# EAGLE design RF-Gen_Controller (EAGLE 6.1)

## Sheet 1 of 3
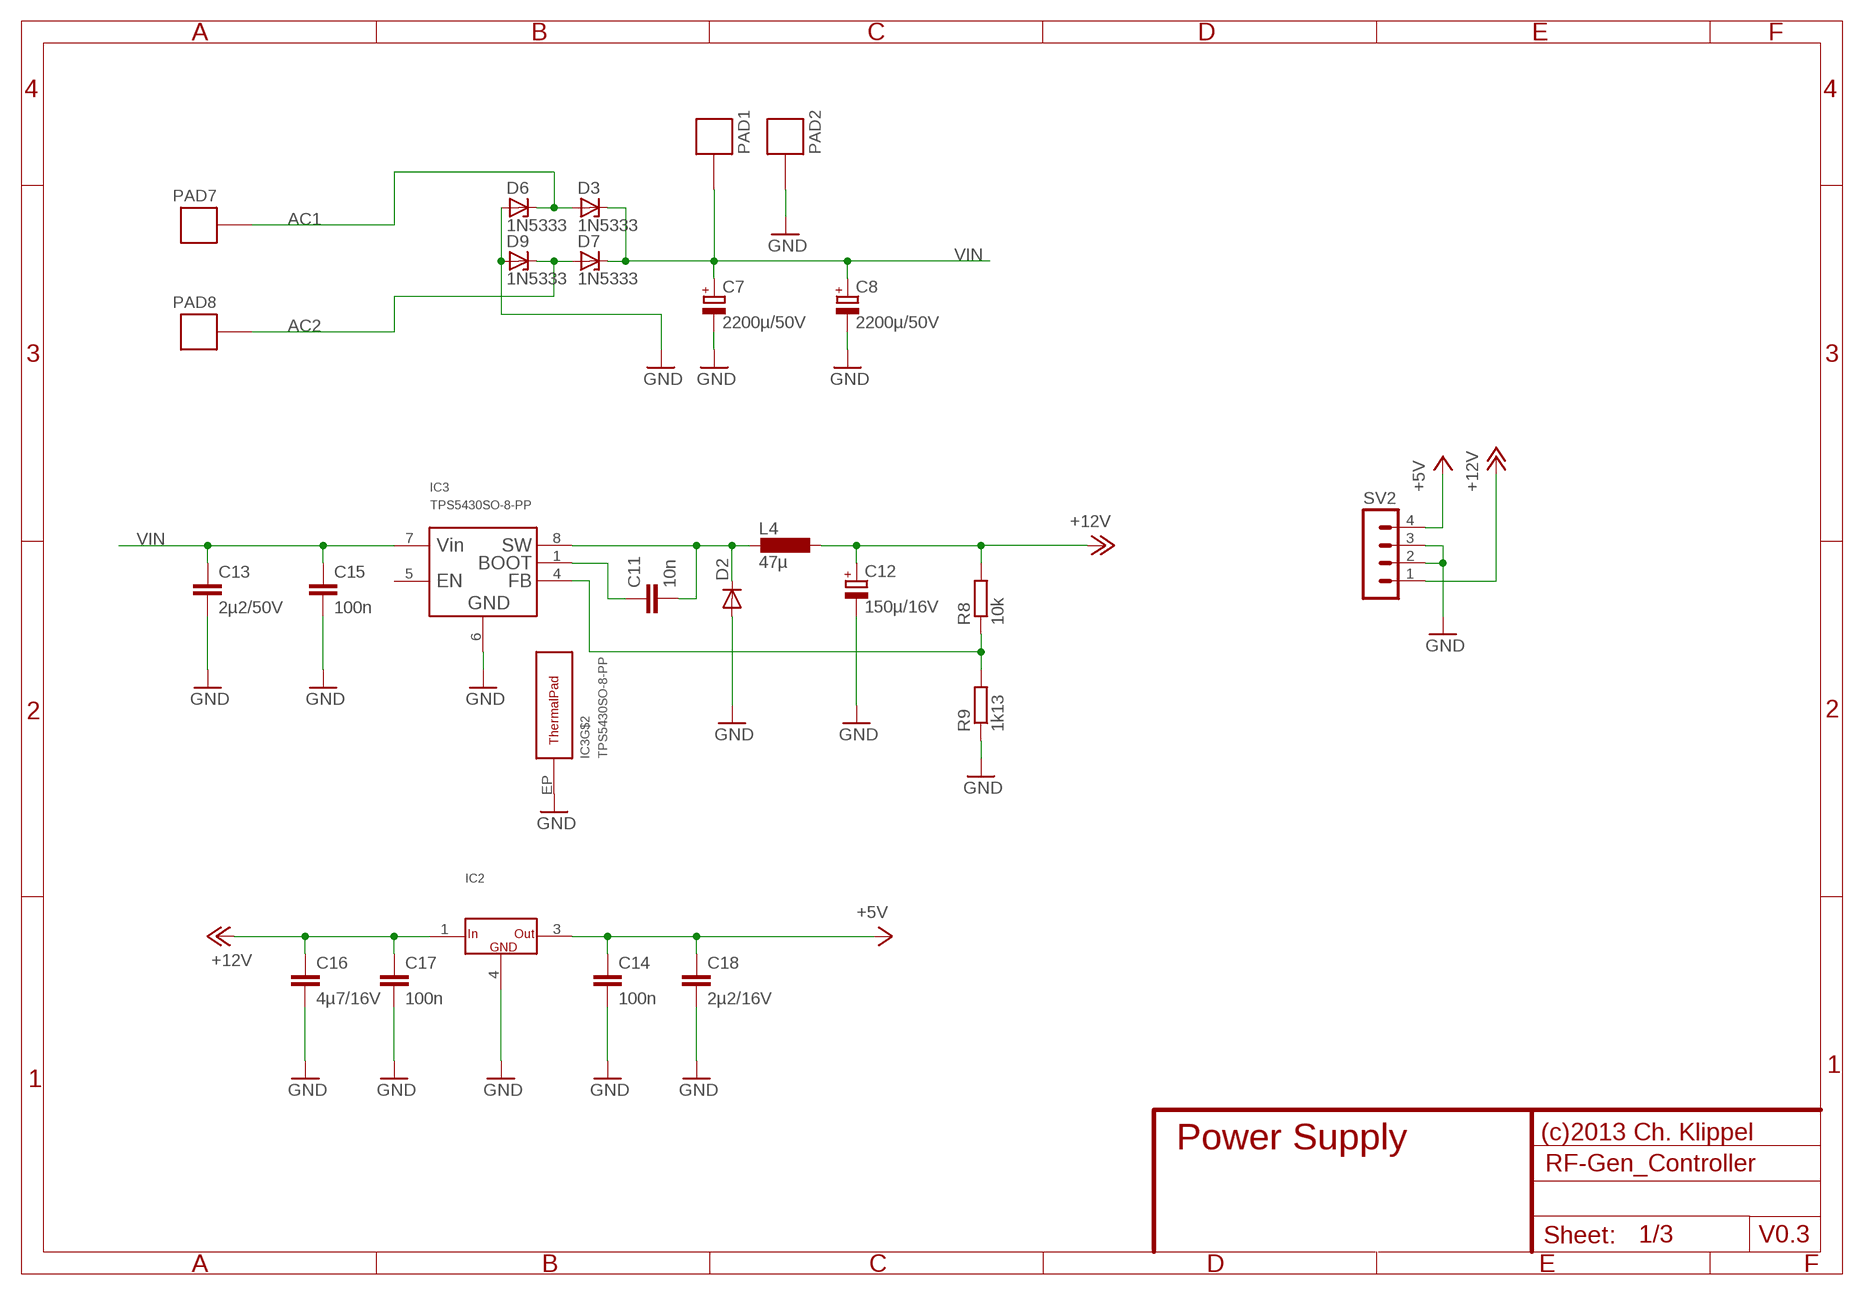
[diagram p0: schematic, sheet 1]

### Parts
C7  2200µ/50V  C-POL-EU-EEUHD1H_VERT2  [CAP_EEUHD1H_VERT2]
C8  2200µ/50V  C-POL-EU-EEUHD1H_VERT2  [CAP_EEUHD1H_VERT2]
C11  10n  C-EU-1206  [C_1206_REFLOW]
C12  150µ/16V  C-POL-EU-AL_100_108  [CAP_AL_100_108]
C13  2µ2/50V  C-EU-1210  [C_1210_REFLOW]
C14  100n  C-EU-0805  [C_0805_REFLOW]
C15  100n  C-EU-0805  [C_0805_REFLOW]
C16  4µ7/16V  C-EU-1210  [C_1210_REFLOW]
C17  100n  C-EU-0805  [C_0805_REFLOW]
C18  2µ2/16V  C-EU-1210  [C_1210_REFLOW]
D2  DIODE-SMB  [SMB]
D3  1N5333  [C1702-15]
D6  1N5333  [C1702-15]
D7  1N5333  [C1702-15]
D9  1N5333  [C1702-15]
IC2  VREG_3DPAK-3  [DPAK-3]
IC3  TPS5430SO-8-PP  [SO-8-PP]
L4  47µ  L-EU-SSR1260  [SSR1260]
PAD1  SOLPAD5MM  [SOLPAD_5]
PAD2  SOLPAD5MM  [SOLPAD_5]
PAD7  SOLPAD5MM  [SOLPAD_5]
PAD8  SOLPAD5MM  [SOLPAD_5]
R8  10k  R-EU-0805  [R_0805_REFLOW]
R9  1k13  R-EU-0805  [R_0805_REFLOW]
SV2  MA04-1  [MA04-1]

### Nets
+5V: C14.P$1 C18.P$1 IC2.3(OUT) SV2.4 ; also sheet 2,3
+12V: C12.+ C16.P$1 C17.P$1 IC2.1(IN) L4.1 R8.P$2 SV2.1 ; also sheet 3
AC1: D3.A D6.C PAD7.P$1
AC2: D7.A D9.C PAD8.P$1
GND: C7.- C8.- C12.- C13.P$2 C14.P$2 C15.P$2 C16.P$2 C17.P$2 C18.P$2 D2.A D6.A D9.A IC2.4(GND) IC3.6(GND) IC3.EP(THERMALPAD) PAD2.P$1 R9.P$1 SV2.2 SV2.3 ; also sheet 2,3
N$11: C11.P$1 IC3.1(BOOT)
N$13: IC3.4(FB) R8.P$1 R9.P$2
SW12: C11.P$2 D2.C IC3.8(SW) L4.2
VIN: C7.+ C8.+ C13.P$1 C15.P$1 D3.C D7.C IC3.7(VIN) PAD1.P$1 ; also sheet 3
Unconnected: IC3.5(EN)

### Notes on the sheet
- (c)2013 Ch. Klippel
- Power Supply
- V0.3

## Sheet 2 of 3
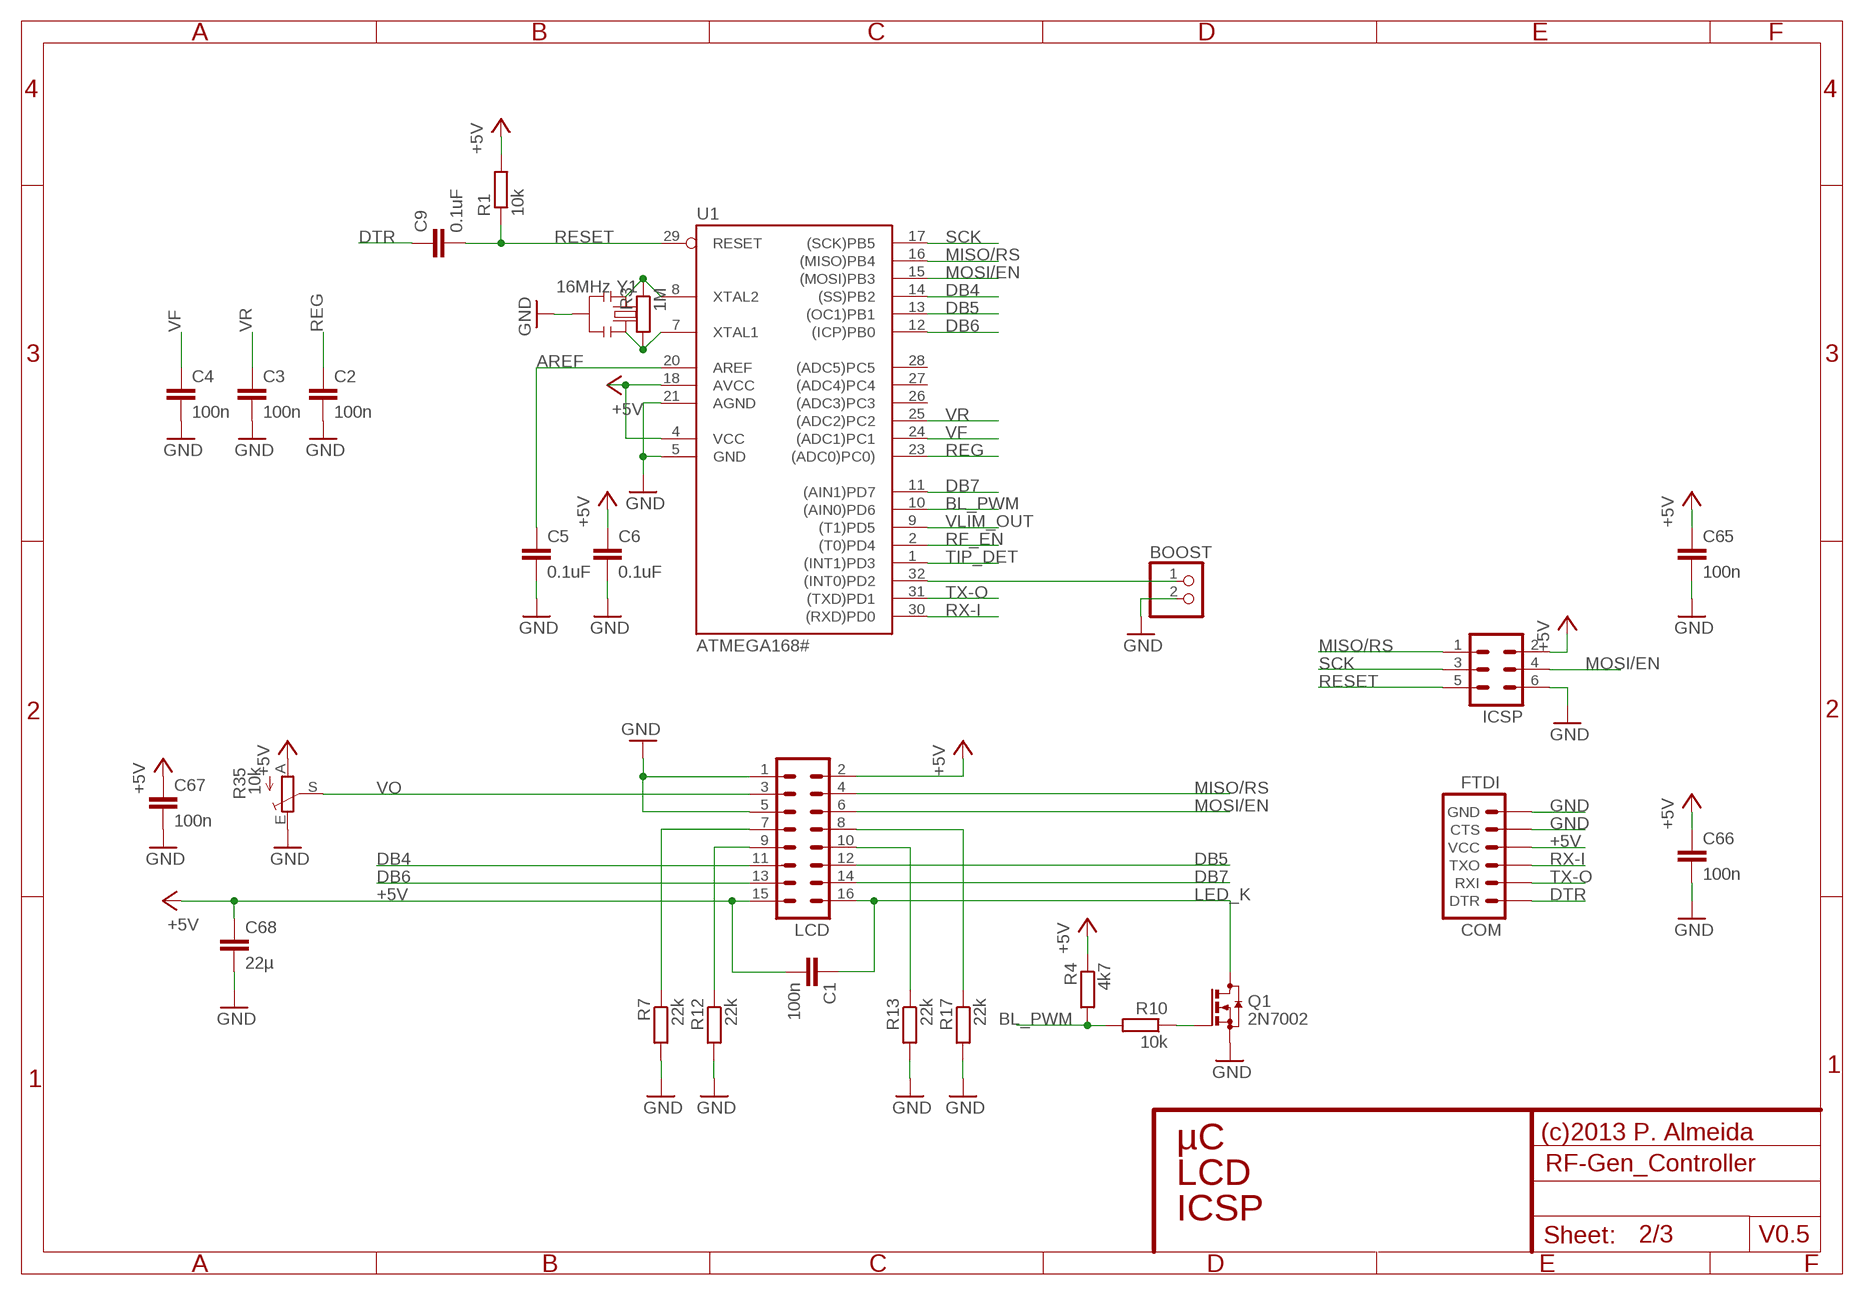
[diagram p1: schematic, sheet 2]

### Parts
BOOST  PINHD-1X2/90  [1X02/90]
C1  100n  C-EU-0805  [C_0805_REFLOW]
C2  100n  C-EU-0805  [C_0805_REFLOW]
C3  100n  C-EU-0805  [C_0805_REFLOW]
C4  100n  C-EU-0805  [C_0805_REFLOW]
C5  0.1uF  C-EU-0805  [C_0805_REFLOW]
C6  0.1uF  C-EU-0805  [C_0805_REFLOW]
C9  0.1uF  C-EU-0805  [C_0805_REFLOW]
C65  100n  C-EU-0805  [C_0805_REFLOW]
C66  100n  C-EU-0805  [C_0805_REFLOW]
C67  100n  C-EU-0805  [C_0805_REFLOW]
C68  22µ  C-EU-1206  [C_1206_REFLOW]
FTDI  COM  ARDUINO_SERIAL_PROGRAMPTH  [1X06]
ICSP  ML6  [ML6]
LCD  ML16  [ML16]
Q1  2N7002  BSS123  [SOT23]
R1  10k  R-EU-0805  [R_0805_REFLOW]
R3  1M  R-EU-0805  [R_0805_REFLOW]
R4  4k7  R-EU-0805  [R_0805_REFLOW]
R7  22k  R-EU-0805  [R_0805_REFLOW]
R10  10k  R-EU-0805  [R_0805_REFLOW]
R12  22k  R-EU-0805  [R_0805_REFLOW]
R13  22k  R-EU-0805  [R_0805_REFLOW]
R17  22k  R-EU-0805  [R_0805_REFLOW]
R35  10k  TRIM_EU-3364W  [3364W]
U1  ATMEGA168#  AT90S4433A  [TQFP32-08]
Y1  16MHz  RESONATORSMD  [RESONATOR-SMD]

### Nets
+5V: C1.P$2 C6.P$1 C65.P$1 C66.P$1 C67.P$1 C68.P$1 FTDI.4(VCC) ICSP.2 LCD.2 LCD.15 R1.P$2 R4.P$1 R35.A U1.4(VCC) U1.18(AVCC) ; also sheet 1,3
AREF: C5.P$1 U1.20(AREF)
BL_PWM: R4.P$2 R10.P$2 U1.10((AIN0)PD6)
DB4: LCD.11 U1.14((SS)PB2)
DB5: LCD.12 U1.13((OC1)PB1)
DB6: LCD.13 U1.12((ICP)PB0)
DB7: LCD.14 U1.11((AIN1)PD7)
DTR: C9.P$1 FTDI.1(DTR)
GND: BOOST.2 C2.P$2 C3.P$2 C4.P$2 C5.P$2 C6.P$2 C65.P$2 C66.P$2 C67.P$2 C68.P$2 FTDI.5(CTS) FTDI.6(GND) ICSP.6 LCD.1 LCD.5 Q1.2(S) R7.P$2 R12.P$2 R13.P$2 R17.P$2 R35.E U1.5(GND) U1.21(AGND) Y1.2 ; also sheet 1,3
LED_K: C1.P$1 LCD.16 Q1.3(D)
MISO/RS: ICSP.1 LCD.4 U1.16((MISO)PB4)
MOSI/EN: ICSP.4 LCD.6 U1.15((MOSI)PB3)
N$3: LCD.9 R12.P$1
N$4: LCD.7 R7.P$1
N$5: LCD.10 R13.P$1
N$8: Q1.1(G) R10.P$1
N$9: BOOST.1 U1.32((INT0)PD2)
N$10: R3.P$1 U1.8(XTAL2) Y1.1
N$12: R3.P$2 U1.7(XTAL1) Y1.3
N$16: LCD.8 R17.P$1
REG: C2.P$1 U1.23((ADC0)PC0)) ; also sheet 3
RESET: C9.P$2 ICSP.5 R1.P$1 U1.29(RESET)
RF_EN: U1.2((T0)PD4) ; also sheet 3
RX-I: FTDI.3(TXO) U1.30((RXD)PD0)
SCK: ICSP.3 U1.17((SCK)PB5)
TIP_DET: U1.1((INT1)PD3) ; also sheet 3
TX-O: FTDI.2(RXI) U1.31((TXD)PD1)
VF: C4.P$1 U1.24((ADC1)PC1) ; also sheet 3
VLIM_OUT: U1.9((T1)PD5) ; also sheet 3
VO: LCD.3 R35.S
VR: C3.P$1 U1.25((ADC2)PC2) ; also sheet 3
Unconnected: U1.26((ADC3)PC3) U1.27((ADC4)PC4) U1.28((ADC5)PC5)

### Notes on the sheet
- (c)2013 P. Almeida
- µC
- LCD
- ICSP
- V0.5

## Sheet 3 of 3
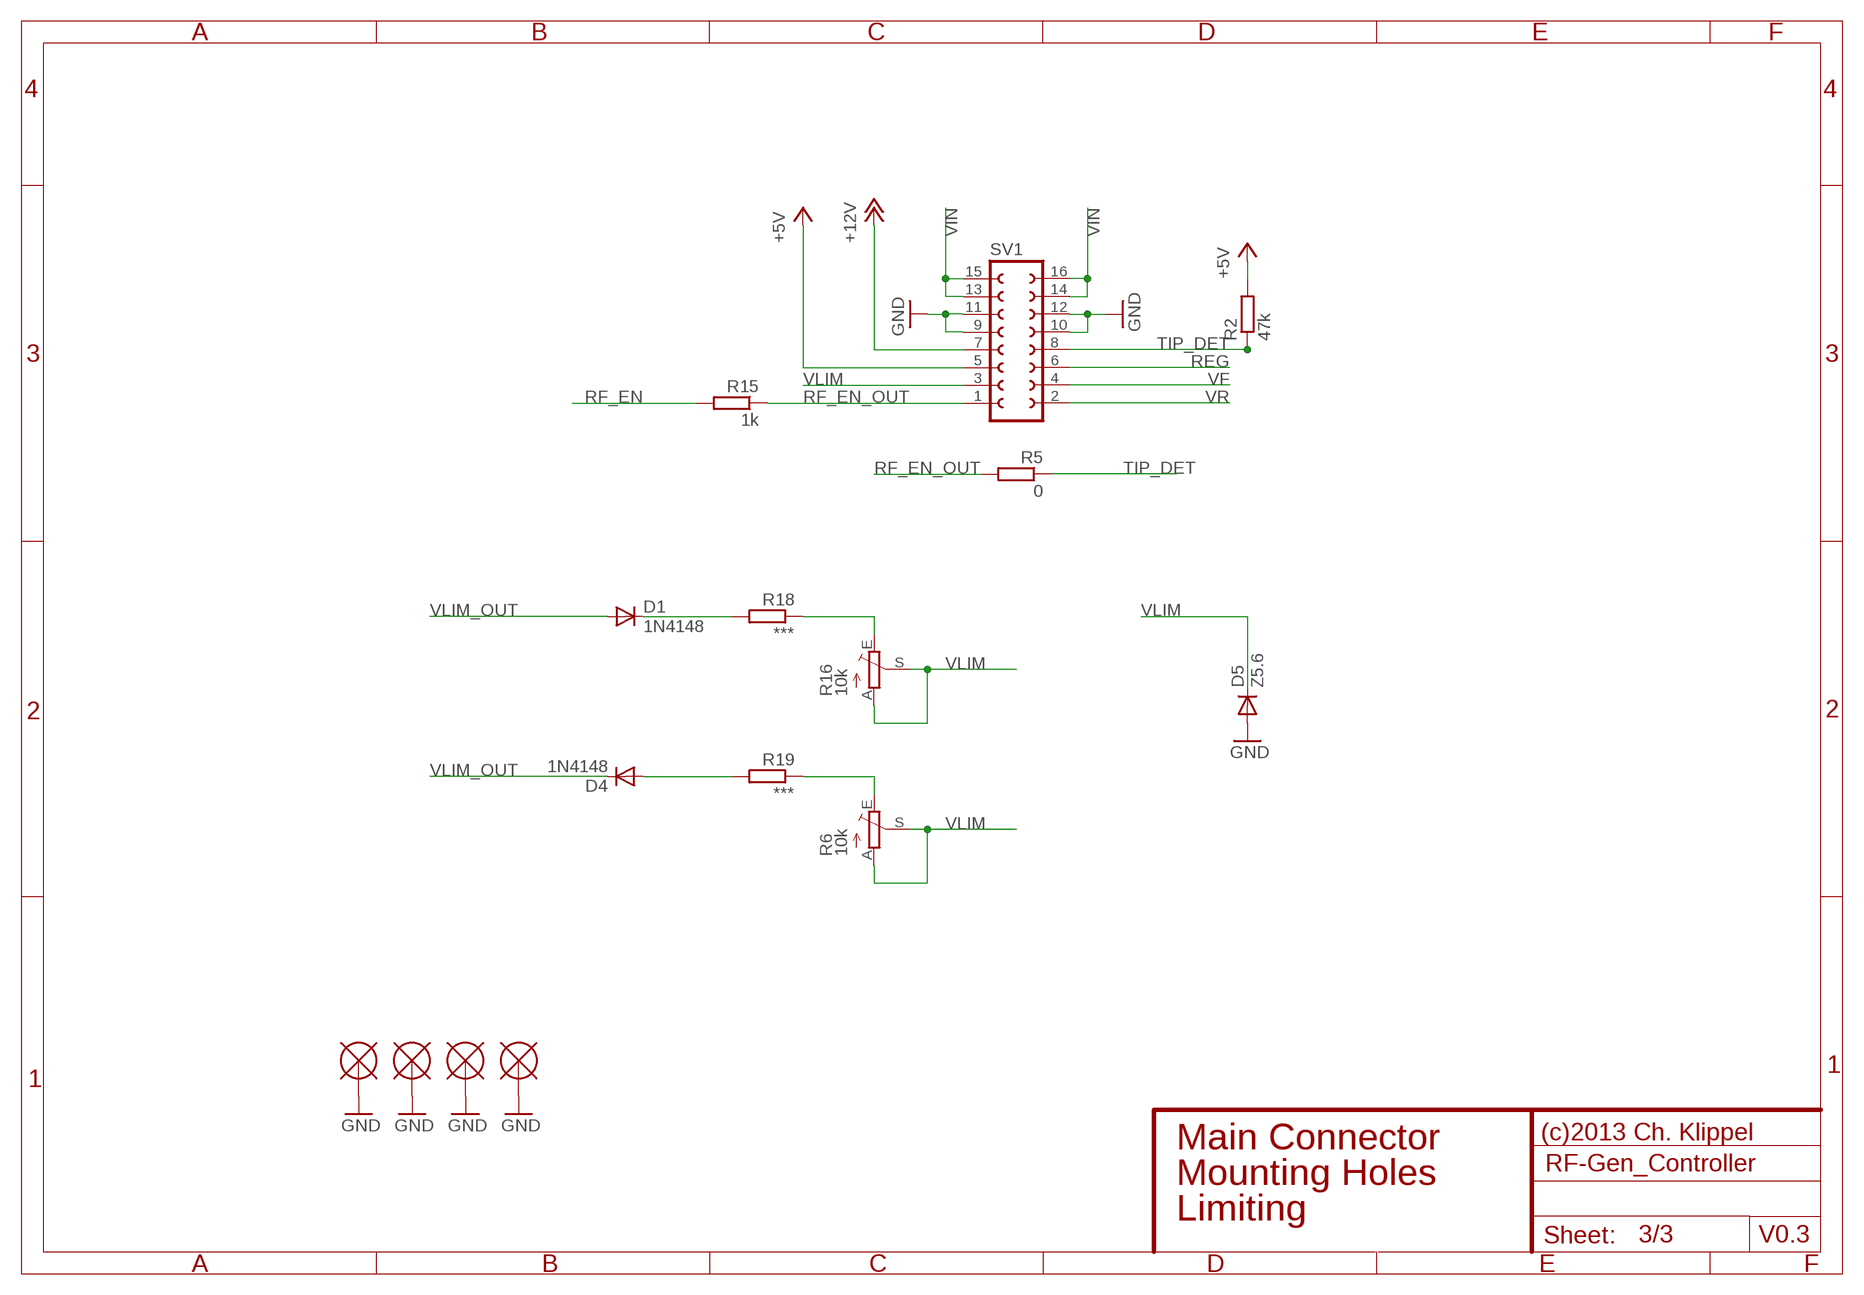
[diagram p2: schematic, sheet 3]

### Parts
D1  1N4148  DIODE-LL-34  [LL-34]
D4  1N4148  DIODE-LL-34  [LL-34]
D5  Z5.6  DIODE-LL-34  [LL-34]
R2  47k  R-EU-0805  [R_0805_REFLOW]
R5  0  R-EU-0805  [R_0805_REFLOW]
R6  10k  TRIM_EU-3364W  [3364W]
R15  1k  R-EU-0805  [R_0805_REFLOW]
R16  10k  TRIM_EU-3364W  [3364W]
R18  ***  R-EU-0805  [R_0805_REFLOW]
R19  ***  R-EU-0805  [R_0805_REFLOW]
SV1  FE08-2  [FE08-2]
U$6  MOUNTPADM3_WASHER  [PAD_M3_WASHER]
U$7  MOUNTPADM3_WASHER  [PAD_M3_WASHER]
U$8  MOUNTPADM3_WASHER  [PAD_M3_WASHER]
U$9  MOUNTPADM3_WASHER  [PAD_M3_WASHER]

### Nets
+5V: R2.P$2 SV1.5 ; also sheet 1,2
+12V: SV1.7 ; also sheet 1
GND: D5.A SV1.9 SV1.10 SV1.11 SV1.12 U$6.P$1 U$7.P$1 U$8.P$1 U$9.P$1 ; also sheet 1,2
N$1: R6.E R19.P$1
N$2: R16.E R18.P$1
N$17: D1.C R18.P$2
N$19: D4.A R19.P$2
REG: SV1.6 ; also sheet 2
RF_EN: R15.P$2 ; also sheet 2
RF_EN_OUT: R5.P$2 R15.P$1 SV1.1
TIP_DET: R2.P$1 R5.P$1 SV1.8 ; also sheet 2
VF: SV1.4 ; also sheet 2
VIN: SV1.13 SV1.14 SV1.15 SV1.16 ; also sheet 1
VLIM: D5.C R6.A R6.S R16.A R16.S SV1.3
VLIM_OUT: D1.A D4.C ; also sheet 2
VR: SV1.2 ; also sheet 2

### Notes on the sheet
- (c)2013 Ch. Klippel
- Main Connector
- Mounting Holes
- Limiting
- V0.3

## Library data of the parts
BOOST = pinhead:PINHD-1X2: PIN HEADER
C1-C6 C9 C11 C13-C18 C65-C68 = parts:C-EU-
C7 C8 C12 = parts:C-POL-EU-
D1 D2 D4 D5 = parts:DIODE-: RECTIFIER DIODES
D3 D6 D7 D9 = diode:1N5333: Z DIODE 3.3 V, 5W, 5 percent (Motorola)
FTDI = SparkFun:ARDUINO_SERIAL_PROGRAM
IC2 = parts:VREG_3
IC3 = parts:TPS5430
ICSP = con-harting-ml:ML6: HARTING; OC_FARNELL: unknown; OC_NEWARK: unknown
L4 = parts:L-EU-
LCD = con-harting-ml:ML16: HARTING
PAD1 PAD2 PAD7 PAD8 = parts:SOLPAD
Q1 = parts:BSS123: N-CHANNEL MOS FET
R1-R5 R7-R10 R12 R13 R15 R17-R19 = parts:R-EU-
R6 R16 R35 = parts:TRIM_EU-: POTENTIOMETER
SV1 = con-lsta:FE08-2: FEMALE HEADER
SV2 = con-lstb:MA04-1: PIN HEADER
U1 = atmel:AT90S4433: MICROCONTROLLER 4 Kbytes FLASH 128 bytes SRAM 256 bytes EEPROM UART 6-channel 10 bit ADC
U$6-U$9 = parts:MOUNTPAD
Y1 = SparkFun:RESONATOR: Resonator Small SMD resonator. This is the itty bitty 10/20MHz resonators with built in caps. CSTCE10M0G55 and CSTCE20M0V53. Footprint has been reviewed closely but hasn't been tested yet.

## Net classes
0 default: width 0.203 mm
1 vcc: width 0.254 mm

## Board
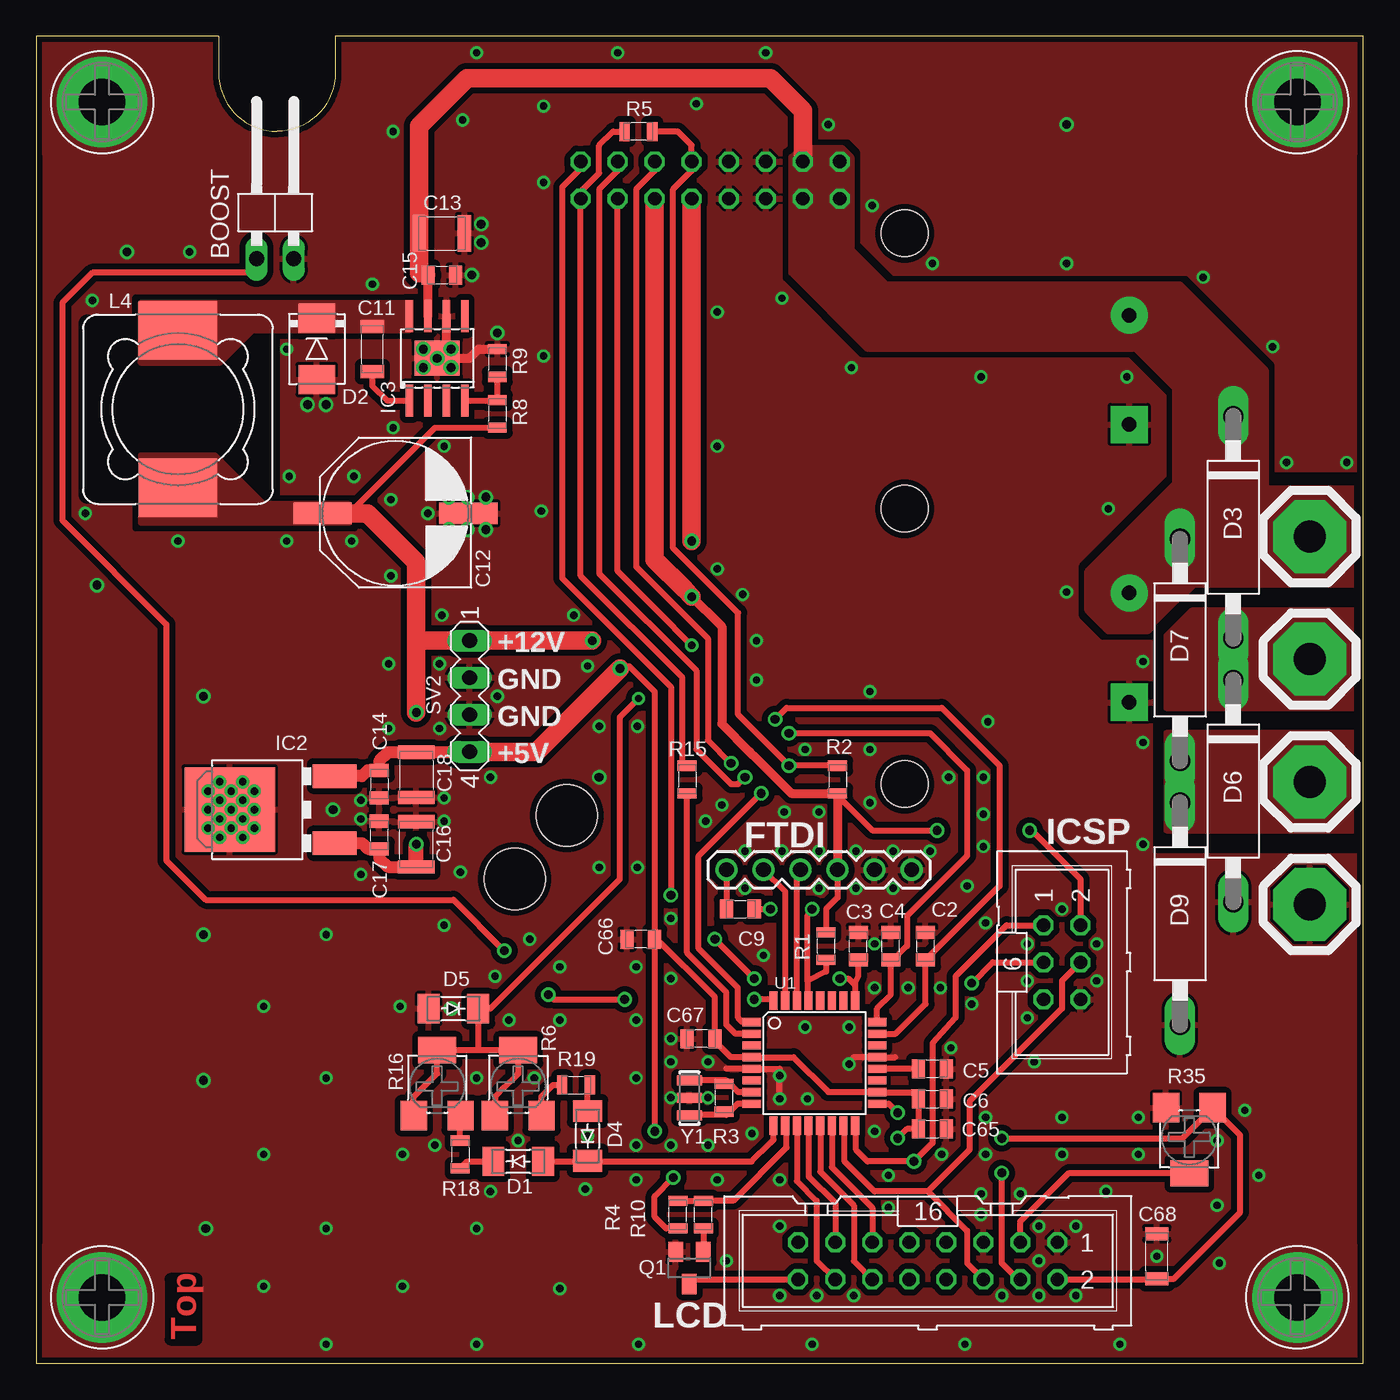
[diagram p3: board, top side]
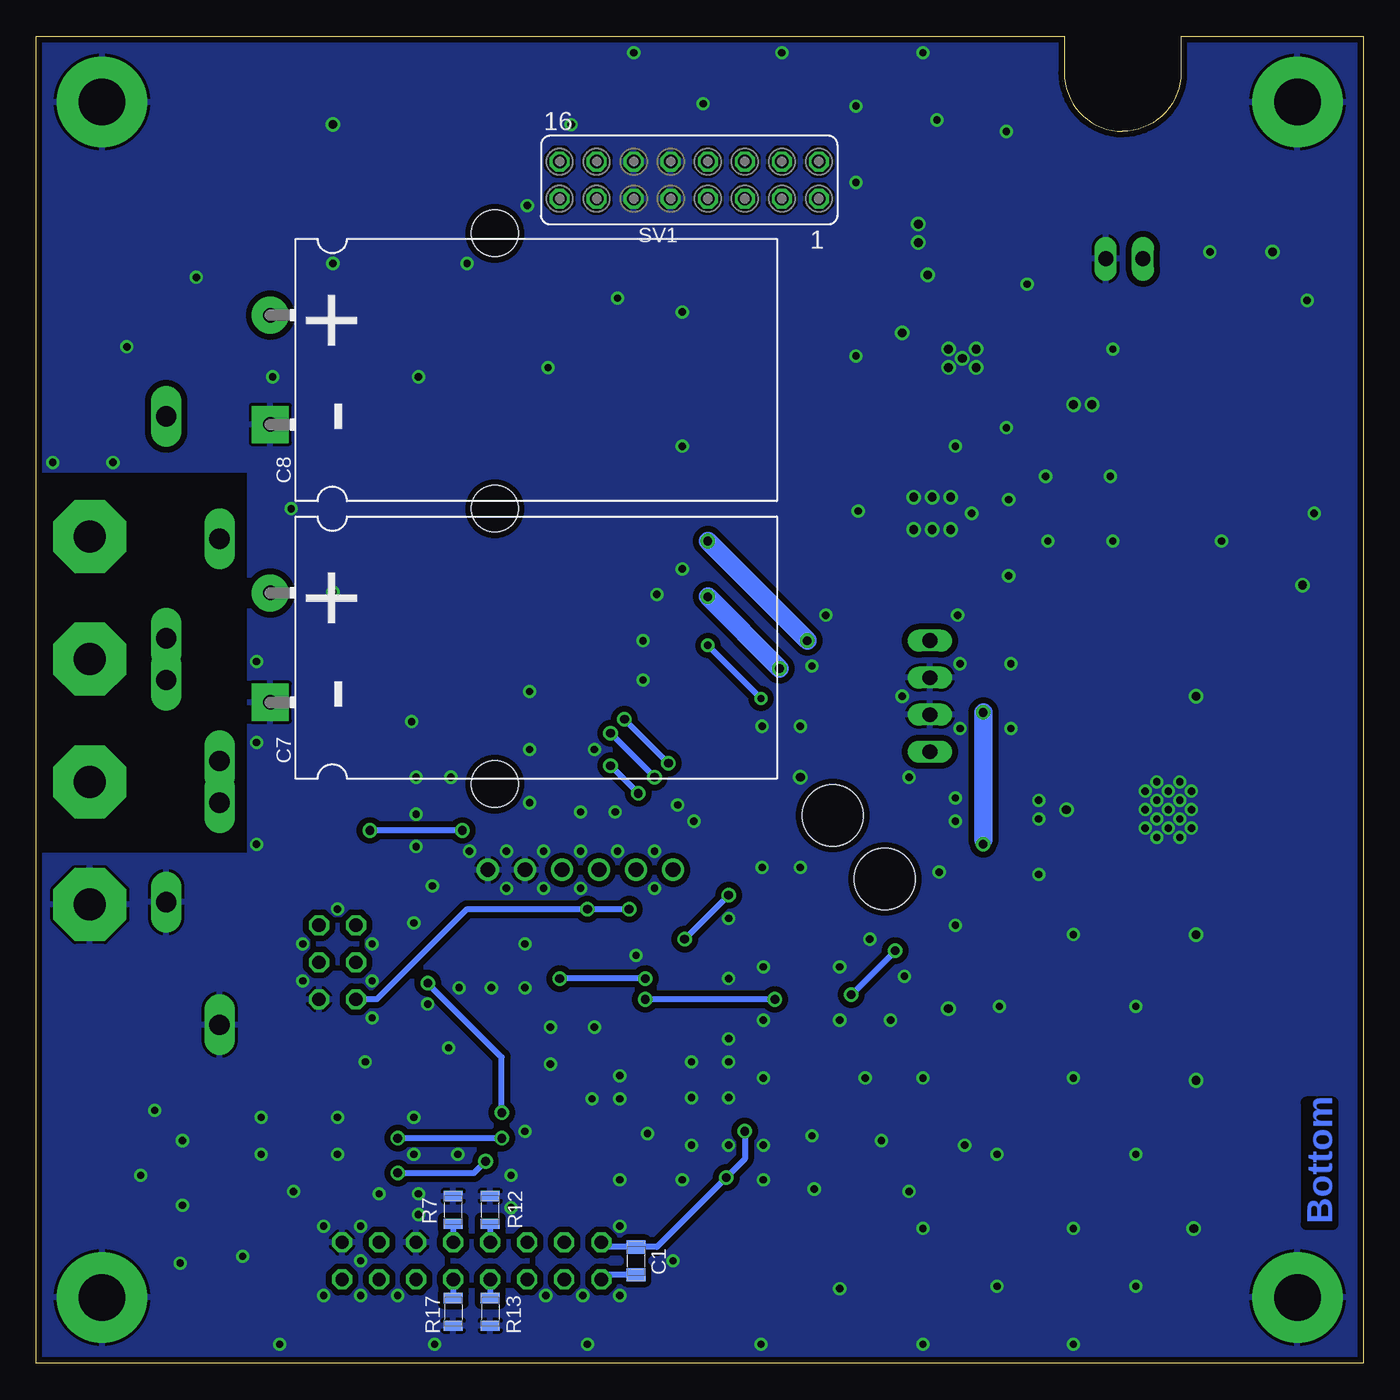
[diagram p4: board, bottom side, seen from below]

Size 91 x 91 mm. Coordinates in mm from the lower left corner, seen from the top.
Outline: 0,0 91,0 91,91 20.5,91 20.5,88.5 arc-90 16.5,84.5 arc-90 12.5,88.5 12.5,91 0,91 0,0
Copper layers (1*16): Top 0.035mm / dielectric 1.5mm / Bottom 0.035mm
Design rules: minimum track width 0.2mm, minimum drill 0.4mm, track to track 0.2mm, track to pad 0.2mm, pad to pad 0.2mm, via to via 0.2mm, smd to smd 0mil, copper to edge 0.4mm, drill to drill 0.2mm, minimum pad ring 0.2mm, minimum via ring 0.2mm, stop-mask expansion 0.1mm, vias tented up to drill 0.6mm, thermal gap 0.2mm
Holes 4.2 mm at 32.81,33.2 36.38,37.57
Holes 3.2 mm at 59.56,77.49 59.55,39.71 59.55,58.6
tRestrict: area 3.5,59.6 to 16.1,71.3

### Footprints (pad centres in the part's own frame; a part is rotated, then mirrored left to right if it is on the bottom)
1X02/90 = drill 1.016 long: 1 -1.27,-3.81; 2 1.27,-3.81
C_0805_REFLOW = smd 0.9 x 1.3: P$1 -0.95,0; P$2 0.95,0
CAP_EEUHD1H_VERT2 = drill 1 pad 2.54: + -3.75,0 | drill 1 pad 2.54 square: - 3.75,0
C_1206_REFLOW = smd 0.9 x 1.6: P$1 -1.55,0; P$2 1.55,0
CAP_AL_100_108 = smd 4 x 1.5: + -5,0; - 5,0
C_1210_REFLOW = smd 0.9 x 2.5: P$1 -1.55,0; P$2 1.55,0
LL-34 = smd 1.5 x 2: A 1.7,0; C -1.7,0
SMB = smd 2 x 2.5: A 2.1,0; C -2.1,0
C1702-15 = drill 1.397 long: A 7.62,0; C -7.62,0
1X06 = drill 1.016: 1 0,0; 2 2.54,0; 3 5.08,0; 4 7.62,0; 5 10.16,0; 6 12.7,0
DPAK-3 = smd 1.6 x 3: 1 -2.3,-4.4; 3 2.3,-4.4 | smd 5.8 x 6.2: 4 0,2.8
SO-8-PP = smd 0.5 x 2.2: 1 -1.905,-2.9; 2 -0.635,-2.9; 3 0.635,-2.9; 4 1.905,-2.9; 5 1.905,2.9; 6 0.635,2.9; 7 -0.635,2.9; 8 -1.905,2.9 | smd 3.1 x 2.4: EP 0,0
ML6 = drill 0.914 octagon: 1 -2.54,-1.27; 2 -2.54,1.27; 3 0,-1.27; 4 0,1.27; 5 2.54,-1.27; 6 2.54,1.27
SSR1260 = smd 4 x 5.4: 1 -5.4,0; 2 5.4,0
ML16 = drill 0.914 octagon: 1 -8.89,-1.27; 2 -8.89,1.27; 3 -6.35,-1.27; 4 -6.35,1.27; 5 -3.81,-1.27; 6 -3.81,1.27; 7 -1.27,-1.27; 8 -1.27,1.27; 9 1.27,-1.27; 10 1.27,1.27; 11 3.81,-1.27; 12 3.81,1.27; 13 6.35,-1.27; 14 6.35,1.27; 15 8.89,-1.27; 16 8.89,1.27
SOLPAD_5 = drill 2.2 pad 5 octagon: P$1 0,0
SOT23 = smd 1 x 1.4: 1 -0.95,-1.1; 2 0.95,-1.1; 3 0,1.1
R_0805_REFLOW = smd 0.7 x 1.3: P$1 -0.95,0; P$2 0.95,0
3364W = smd 1.8 x 2: A -1.6,-2.1; E 1.6,-2.1 | smd 2.6 x 1.8: S 0,2.4
FE08-2 = drill 0.914 octagon: 1 -8.89,1.27; 2 -8.89,-1.27; 3 -6.35,1.27; 4 -6.35,-1.27; 5 -3.81,1.27; 6 -3.81,-1.27; 7 -1.27,1.27; 8 -1.27,-1.27; 9 1.27,1.27; 10 1.27,-1.27; 11 3.81,1.27; 12 3.81,-1.27; 13 6.35,1.27; 14 6.35,-1.27; 15 8.89,1.27; 16 8.89,-1.27
MA04-1 = drill 1.016 long: 1 -3.81,0; 2 -1.27,0; 3 1.27,0; 4 3.81,0
TQFP32-08 = smd 1.27 x 0.559: 1 -4.293,2.8; 2 -4.293,2; 3 -4.293,1.2; 4 -4.293,0.4; 5 -4.293,-0.4; 6 -4.293,-1.2; 7 -4.293,-2; 8 -4.293,-2.8; 17 4.293,-2.8; 18 4.293,-2; 19 4.293,-1.2; 20 4.293,-0.4; 21 4.293,0.4; 22 4.293,1.2; 23 4.293,2; 24 4.293,2.8 | smd 0.559 x 1.27: 9 -2.8,-4.293; 10 -2,-4.293; 11 -1.2,-4.293; 12 -0.4,-4.293; 13 0.4,-4.293; 14 1.2,-4.293; 15 2,-4.293; 16 2.8,-4.293; 25 2.8,4.293; 26 2,4.293; 27 1.2,4.293; 28 0.4,4.293; 29 -0.4,4.293; 30 -1.2,4.293; 31 -2,4.293; 32 -2.8,4.293
PAD_M3_WASHER = drill 3.2 pad 6.2: P$1 0,0
RESONATOR-SMD = smd 0.7 x 1.7: 1 -1.2,0; 2 0,0; 3 1.2,0

### Placement (x,y rotation side)
BOOST  16.38,79.56 0 top
C1  49.87,7.01 90 bottom
C2  60.98,28.6 90 top
C3  56.38,28.6 90 top
C4  58.6,28.6 90 top
C5  61.46,20.18 0 top
C6  61.46,18.12 0 top
C7  74.95,49.08 270 bottom
C8  74.95,68.13 270 bottom
C9  48.28,31.14 0 top
C11  23.04,69.56 90 top
C12  24.63,58.29 0 top
C13  27.8,77.49 0 top
C14  23.52,39.71 270 top
C15  27.8,74.64 0 top
C16  26.06,35.58 90 top
C17  23.52,36.22 90 top
C18  26.06,40.35 270 top
C65  61.46,16.06 0 top
C66  41.46,29.08 180 top
C67  45.59,22.25 180 top
C68  76.86,7.33 90 top
D1  33.04,13.83 0 top
D2  19.23,69.56 270 top
D3  82.1,57.33 270 top
D4  37.81,15.58 90 top
D5  28.6,24.31 180 top
D6  82.1,39.23 270 top
D7  78.45,48.92 270 top
D9  78.45,30.82 270 top
FTDI  47.33,33.84 0 top
IC2  16.06,37.96 90 top
IC3  27.49,68.92 0 top
ICSP  70.35,27.49 270 top
L4  9.71,65.43 90 top
LCD  61.14,7.01 180 top
PAD1  87.34,56.7 0 top
PAD2  87.34,31.46 0 top
PAD7  87.34,48.28 0 top
PAD8  87.34,39.87 0 top
Q1  44.79,6.53 180 top
R1  54.16,28.6 90 top
R2  54.95,40.03 270 top
R3  47.17,18.2 90 top
R4  44,10.18 90 top
R5  41.3,84.48 180 top
R6  33.04,19.07 0 top
R7  62.41,10.5 90 bottom
R8  31.61,65.11 270 top
R9  31.61,68.6 270 top
R10  45.74,10.18 90 top
R12  59.87,10.5 90 bottom
R13  59.87,3.52 270 bottom
R15  44.63,40.03 270 top
R16  27.49,19.07 0 top
R17  62.41,3.52 270 bottom
R18  29.08,14.31 270 top
R19  37.01,19.07 0 top
R35  79.08,15.42 180 top
SV1  46.22,81.14 180 bottom
SV2  29.71,45.74 270 top
U1  53.36,20.58 0 top
U$6  86.5,86.5 0 top
U$7  86.5,4.5 0 top
U$8  4.5,86.5 0 top
U$9  4.5,4.5 0 top
Y1  44.79,18.2 90 top

### Tracks (layer width: path | path; a pad name or v marks a point on that pad's centre or on a via)
+5V  (via drill 0.6, 0.6 pad 1.02)
  Top 0.406: v40.03,47.65 40.03,47.81 40.66,47.81 42.41,46.06 C66.P$1 42.41,34.63 42.41,29.23 | U1.4 47.65,20.98 46.7,21.93 C67.P$1 46.53,25.11 42.41,29.23 | U1.4 | U1.4 51.94,20.98 54.32,18.6 57.64,18.6 U1.18 60.05,18.58 C6.P$1 C65.P$1 | FTDI.4 54.95,31.93 54.16,31.14 R1.P$2 54.16,29.39 | R2.P$2 54.95,38.92 57.33,36.54 v61.78,36.54 | v68.13,36.54 68.29,36.54 71.62,33.2 ICSP.2 | LCD.2 76.86,5.74 C68.P$1 | C68.P$1 | C68.P$1 77.02,5.74 | 77.02,5.74 | 77.02,5.74 76.9,5.74 C68.P$1 | C68.P$1 78.01,5.78 82.57,10.34 82.57,15.63 R35.A 80.49,17.33 80.51,17.33 78.61,15.42 v66.22,15.42 | C65.P$1 | C65.P$1 59.71,16.06 v59.08,15.42 | 42.41,29.23 v42.41,15.9 | 43.66,12.7 v43.68,12.72 42.41,11.45 42.41,10.03 43.2,9.23 R4.P$1
  Top 0.61: v44.95,52.57 44.79,52.73 47.01,50.51 47.01,43.84 48.92,41.93 49.4,41.45 51.78,39.08 R2.P$2 54.95,38.92 FTDI.4
  Top 0.813: IC2.3 22.33,40.27 22.72,40.66 C14.P$1 23.52,41.3 24.12,41.9 C18.P$1 29.67,41.9 SV2.4
  Top 1.27: v44.95,52.57 44.47,53.05 42.41,55.11 SV1.5 | v40.03,47.65 34.31,41.93 SV2.4
  Bottom 0.406: v59.08,15.42 v66.22,15.42 | LCD.15 51.93,7.96 C1.P$2 48.44,7.96 v43.68,12.72 42.41,13.99 v42.41,15.9 | v61.78,36.54 v68.13,36.54
  Bottom 1.27: v40.03,47.65 v44.95,52.57
+12V  (via drill 0.6 pad 0.81, 0.6 pad 1.02)
  Top 0.406: R8.P$2 27.33,64.16 21.45,58.28 19.71,58.28 | 19.71,58.28 | 19.71,58.28 C12.+
  Top 0.813: IC2.1 22.33,35.66 22.72,35.27 C17.P$1 23.52,34.63 24.12,34.03 C16.P$1 26.06,34.31 | 26.06,34.31
  Top 1.016: 26.06,34.31 v26.06,35.58
  Top 1.27: 19.55,58.28 | 19.55,58.28 C12.+ | 19.55,58.28 21.45,58.28 22.73,58.28 26.06,54.95 26.06,49.55 | v44.95,56.38 SV1.7 | SV2.1 | v38.12,49.55 37.97,49.55 SV2.1 | v26.06,44.63 26.06,49.55 | 26.06,49.55 SV2.1
  Bottom 1.016: v26.06,35.58 26.06,35.9
  Bottom 1.27: v38.12,49.55 v44.95,56.38 | 26.06,35.9 v26.06,44.63
  pour Top (rank 3, no thermals): 7.17,62.25 7.17,57.65 21.45,57.65 21.45,58.92 15.58,58.92 12.25,62.25
AC1
  pour Top (isolate 0.61, no thermals): 90.99,51.62 79.24,51.62 77.49,49.87 77.49,44.95 79.72,44.95 80.51,44.95 80.51,44.95 81.94,44.95 82.89,44.95 90.99,44.95
AC2
  pour Top (isolate 0.61, no thermals): 90.99,43.2 83.69,43.2 83.68,43.2 82.1,43.2 81.78,43.2 81.78,43.2 77.49,43.2 77.49,41.93 77.49,37.81 77.49,36.54 90.99,36.54
AREF
  Top 0.406: C5.P$1 U1.20
BL_PWM
  Top 0.406: U1.10 51.46,16.38 51.46,14.79 47.81,11.14 46.54,11.14 R10.P$2 R4.P$2
DB4
  Top 0.406: U1.14 54.56,13.43 57.33,10.66 LCD.11 57.33,8.12
DB5
  Top 0.406: U1.13 53.76,13.12 56.06,10.82 56.06,7.01 57.49,5.58 | 57.49,5.58 | 57.49,5.58 LCD.12
DB6
  Top 0.406: U1.12 52.96,12.81 54.79,10.98 LCD.13 54.79,8.12
DB7
  Top 0.406: U1.11 52.16,12.49 53.52,11.14 53.52,7.01 LCD.14
DTR
  Top 0.406: FTDI.1 C9.P$1
GND  (via drill 0.5, 0.6)
  Top 0.406: U1.5 | U1.5 50.98,20.18 v50.98,18.12 | U1.21 | U1.21 56.06,20.98 | U1.21 58.92,20.98 | U1.5 47.33,20.18
  Top 0.61: IC3.6 28.12,69.56 IC3.EP | R9.P$1 30.34,69.55 29.71,68.92 IC3.EP | IC3.EP | C15.P$2 | C15.P$2
  other vias: 27.49,68.92 18.6,65.75 19.87,65.75 28.44,68.29 28.44,69.56 26.54,69.56 26.54,68.29 31.61,70.67 29.87,74.64 30.5,76.86 30.5,78.13 29.55,57.17 30.82,57.17 28.28,57.17 28.28,59.4 29.55,59.4 30.82,59.4 35.9,23.52 24.95,24.47 41.14,19.55 24.15,47.97 64.79,11.61 49.08,15.74 55.75,20.5 14.15,36.06 64.16,24.63 14.15,38.6 13.36,36.7 13.36,37.97 14.15,37.33 13.36,39.23 43.52,26.38 46.06,14.95 59.79,25.74 57.49,25.74 50.98,4.63 62.73,21.61 73.37,11.77 68.76,9.39 67.49,11.61 43.52,14.95 53.52,4.63 68.76,4.63 41.14,12.57 30.19,9.23 25.11,5.26 31.46,26.54 19.87,19.55 25.11,14.31 15.58,14.31 15.58,5.26 15.58,24.47 35.9,5.1 19.87,9.23 33.84,29.08 38.6,34 35.9,27.17 55.75,23.04 28.44,24.31 38.6,40.19 17.33,60.83 24.47,64.16 21.77,60.83 9.71,56.38 21.61,56.38 17.17,56.38 24.31,59.24 27.96,62.89 11.45,19.39 11.61,9.23 17.17,69.56 26.85,58.29 3.36,58.29 14.15,39.87 32.41,23.52 30.19,19.55 33.04,15.26 27.33,14.95 34.15,19.55 19.87,1.29 30.19,1.29 41.3,1.29 53.2,1.29 63.68,1.29 74.32,1.29 64.79,10.18 12.56,38.6 12.56,37.33 12.56,39.87 12.56,36.06 14.95,36.7 14.95,37.97 14.95,39.24 11.77,39.24 11.77,37.97 11.77,36.7 27.96,38.76 27.96,37.17 22.25,37.33 22.25,38.6 24.15,43.52 37.81,47.81 38.6,43.68 31.14,40.19 27.96,30.03 31.14,11.77 19.87,29.39 41.22,43.68 22.25,33.52 62.1,14.31 63.84,32.73 52.73,42.09 49.4,46.86 48.44,52.73 46.7,54.48 46.7,62.89 46.7,72.1 51.14,73.05 55.9,68.29 64.79,67.65 75.91,48.13 75.91,42.57 37.65,11.93 3.83,72.89 10.5,76.22 23.04,74 24.47,84.48 30.19,89.88 39.87,89.88 50.03,89.88 54.32,84.96 29.23,85.27 34.79,86.23 45.27,86.38 57.33,79.4 61.46,75.43 70.67,75.43 80.03,74.48 85.75,61.78 84.8,69.72 34.79,80.99 34.79,69.08 34.63,58.44 36.85,51.3 27.8,51.3 45.9,37.17 47.01,38.28 80.99,10.82 81.14,6.85 80.99,15.26 24.31,54 11.45,29.39 20.34,37.97 57.49,15.9 62.02,25.74 56.06,4.63 66.22,4.63 58.76,32.57 61.3,35.11 76.86,7.33 43.52,18.2 37.81,15.58 46.7,12.57 47.33,7.01 58.44,12.88 50.98,12.57 57.49,28.76 70.35,31.14 57.17,42.09 51.3,37.81 65.11,16.85 49.87,27.96 58.76,35.11 64.95,37.65 65.27,44 64.95,40.19 57.17,46.06 49.4,49.55 56.22,32.57 56.22,35.11 43.52,22.25 43.52,20.66 41.22,34 58.44,10.66 27.65,43.52 27.65,47.97 31.61,45.74 75.59,16.85 75.59,14.31 41.14,27.17 41.14,23.52 41.14,14.95 29.07,33.68 11.45,45.74 6.21,76.22 70.67,84.95 4.15,53.36 64.95,35.43 52.89,18.12 50.98,19.71 46.06,20.66 82.89,17.33 67.97,26.22 72.73,28.76 83.84,12.88 67.97,28.76 52.73,23.04 43.52,30.5 48.6,35.11 51.14,35.11 53.68,35.11 50.98,9.39 71.3,4.63 71.3,9.39 57.17,38.44 62.57,40.19 53.68,37.81 75.91,35.58 73.52,58.6 74.79,67.65 70.67,52.89 89.88,61.78 65.11,30.19 70.35,16.85 67.97,23.68 72.73,26.22 68.44,20.66 65.11,14.31 70.35,14.31 68.76,7.01 48.6,32.57 53.68,32.57 46.06,18.2
  pour Top (rank 4, no thermals): 0.18,90.83 7.96,90.83 7.96,83.05 0.18,83.05
  pour Top (isolate 0.356, rank 4, no thermals): -0.14,7.96 7.96,7.96 7.96,-0.13 -0.14,-0.13
  pour Top (isolate 0.356, rank 4, no thermals): 83.05,7.96 90.83,7.96 90.83,-0.13 83.05,-0.13
  pour Top (isolate 0.356, rank 4, no thermals): 83.05,90.83 90.83,90.83 90.83,83.05 83.05,83.05
  pour Bottom (isolate 0.406, rank 4): 0.02,0.02 0.02,90.99 90.99,90.99 90.99,61.3 76.38,61.3 76.38,34.79 90.99,34.79 90.99,0.02
  pour Top (isolate 0.406, rank 5): 0.02,0.02 0.02,90.99 90.99,90.99 90.99,61.3 78.92,61.3 78.76,61.3 76.38,59.08 76.38,34.79 90.99,34.79 90.99,0.02
  pour Top (isolate 0.406): 52.41,33.84 52.41,31.14 54.95,31.14 54.95,33.84
  pour Top (isolate 0.406): 47.33,33.68 47.33,31.14 49.87,31.14 49.87,33.84 47.33,33.84
LED_K
  Top 0.406: Q1.3 44.79,5.74 51.92,5.75 LCD.16
  Bottom 0.406: C1.P$1 51.93,6.06 LCD.16
MISO/RS  (via drill 0.6)
  Top 0.406: v66.22,13.04 66.22,6.85 67.33,5.74 LCD.4 | U1.16 56.16,16.23 56.22,16.23 56.22,14.63 57.02,13.84 v60.19,13.84 61.46,15.11 61.46,21.93 63.05,23.68 63.05,26.54 66.54,30.03 ICSP.1
  Bottom 0.406: v66.22,13.04 60.98,13.04 v60.19,13.84
MOSI/EN
  Top 0.406: 61.14,11.77 64,14.63 64,17.96 70.35,24.31 70.35,26.22 ICSP.4 | 61.14,11.77 57.49,11.77 55.43,13.84 55.43,16.22 U1.15 | 61.14,11.77 63.84,9.07 63.84,6.85 LCD.6 | LCD.6
N$1
  Top 0.406: R19.P$1 35.42,19.07 34.64,18.29 R6.E
N$2
  Top 0.406: 29.07,17.01 29.09,17.01 R16.E | R18.P$1 29.07,17.01 | 29.07,17.01
N$3
  Bottom 0.406: R12.P$1 LCD.9
N$4
  Bottom 0.406: R7.P$1 LCD.7 | LCD.7
N$5
  Bottom 0.406: LCD.10 R13.P$1
N$8
  Top 0.406: R10.P$1 45.74,7.95 Q1.1
N$9  (via drill 0.6)
  Top 0.406: BOOST.1 15.11,74.8 3.83,74.8 1.77,72.73 1.77,57.81 8.91,50.66 8.91,34.47 11.61,31.77 28.6,31.77 v32.09,28.28 | U1.32 50.59,24.87 50.51,24.95 v49.24,24.95 | v35.11,25.27 35.42,24.95 v40.35,24.95
  Bottom 0.406: v32.09,28.28 v35.11,25.27 | v40.35,24.95 v49.24,24.95
N$10
  Top 0.406: U1.8 48.1,17.78 47.33,17.01 | 47.33,17.01 45.42,17.01 Y1.1 | R3.P$1 47.33,17.25 47.33,17.01
N$11
  Top 0.406: IC3.1 24.04,66.02 23.04,67.02 C11.P$1
N$12
  Top 0.406: U1.7 48.14,18.58 47.33,19.39 47.17,19.39 | 47.17,19.39 45.11,19.39 Y1.3 | R3.P$2 47.17,19.39
N$13
  Top 0.406: IC3.4 31.57,66.02 R8.P$1 R9.P$2
N$14
  pour Bottom (isolate 0.406): 71.62,30.03 69.08,30.03 69.08,27.49 71.62,27.49
N$15
  pour Top (isolate 0.406): 69.08,30.03 69.08,27.49 71.62,27.49 71.62,30.03
N$16
  Bottom 0.406: LCD.8 R17.P$1
N$17
  Top 0.406: R18.P$2 | R18.P$2 | D1.C 29.55,13.84 R18.P$2
N$18
  pour Top (isolate 0.406): 57.33,8.28 62.41,8.28 62.41,5.74 57.33,5.74
N$19
  Top 0.406: R19.P$2 37.96,18.91 37.97,18.91 37.81,18.76 D4.A
N$20
  pour Bottom (isolate 0.406): 57.33,8.28 62.41,8.28 62.41,5.74 57.33,5.74
N$21
  pour Top (isolate 0.406): 51.78,40.82 51.78,39.08 54.95,39.08 54.95,40.98 51.78,40.98
N$22
  pour Top (isolate 0.406): 47.49,33.84 45.43,33.84 45.43,30.19 47.49,30.19
N$23
  pour Top (isolate 0.305): 57.49,20.18 57.49,18.6 60.51,18.6 60.51,20.18
REG  (via drill 0.6)
  Top 0.406: U1.23 58.94,22.58 60.98,24.63 C2.P$1 | SV1.6 42.41,81.78 41.14,80.51 41.14,54.63 46.06,49.71 46.06,42.73 v47.65,41.14 | v50.66,44.16 51.46,44.95 62.09,44.95 66.06,40.98 66.06,32.73 C2.P$1 | C2.P$1 60.83,27.49
  Bottom 0.406: v47.65,41.14 v50.66,44.16
RESET  (via drill 0.6)
  Top 0.406: R1.P$1 54.16,26.85 52.89,26.22 | 52.89,26.22 52.89,25.11 | 52.89,25.11 52.89,24.79 | 52.89,26.22 52.89,30.66 v53.2,31.14 | C9.P$2 v50.35,31.14 | U1.29 52.96,25.03 52.89,25.11
  Bottom 0.406: v50.35,31.14 v53.2,31.14 61.46,31.14 67.65,24.95 ICSP.5
RF_EN
  Top 0.406: U1.2 47.95,22.58 47.33,23.2 47.33,25.42 44.63,28.12 44.63,38.76 R15.P$2
RF_EN_OUT
  Top 0.406: R5.P$2 39.55,84.48 38.6,83.53 38.6,81.62 37.33,80.35 SV1.1 37.33,54 44.31,47.01 44.31,40.98 R15.P$1
RX-I
  Top 0.406: U1.30 52.16,33.59 FTDI.3
SCK  (via drill 0.6)
  Top 0.406: U1.17 58.47,17.78 v59.08,17.17 | v64.16,26.06 65.59,27.49 ICSP.3
  Bottom 0.406: v59.08,17.17 59.08,20.98 v64.16,26.06
SW12
  pour Top (rank 3, no thermals): 7.17,68.6 7.17,72.73 25.58,72.73 25.58,70.83 14.79,70.83 12.56,68.6
TIP_DET  (via drill 0.6)
  Top 0.406: R5.P$1 44,84.48 44.95,83.53 SV1.8 44.95,81.78 43.68,80.51 43.68,55.9 48.12,51.46 48.12,44.47 v51.62,40.98 51.78,40.98 54.48,40.98 54.63,40.98 R2.P$1 | U1.1 48.44,23.38 48.12,23.68 48.12,25.75 45.43,28.44 45.43,34.79 v49.71,39.08
  Bottom 0.406: v49.71,39.08 v51.62,40.98
TX-O
  Top 0.406: U1.31 51.36,32.34 FTDI.2
VF  (via drill 0.6)
  Top 0.406: U1.24 57.66,24.32 58.6,25.27 58.6,27.49 | 58.6,27.49 | 58.6,27.49 C4.P$1 | SV1.4 39.87,81.78 38.6,80.51 38.6,54.16 45.27,47.49 45.27,42.09 47.65,39.71 48.12,39.71 v48.6,40.19 | v51.62,43.2 61.3,43.2 63.84,40.66 63.84,34.79 59.71,30.66 59.71,28.6 58.6,27.49 | C4.P$1 | 58.6,27.49 C4.P$1
  Bottom 0.406: v48.6,40.19 v51.62,43.2
VIN
  Top 0.406: 26.25,77.33 C13.P$1
  Top 0.61: C15.P$1 | C15.P$1 | IC3.7 C15.P$1
  Top 1.016: 26.38,74.64 | C15.P$1 26.38,74.64 | 26.38,74.64 26.25,74.76
  Top 1.27: SV1.14 52.57,85.91 50.35,88.13 29.55,88.13 26.25,84.83 26.25,77.33 26.25,74.76
  pour Top (isolate 0.61, rank 4, no thermals): 84.32,60.03 90.99,60.03 90.99,53.36 79.4,53.36 76.22,50.19 73.53,50.19 72.1,51.62 72.1,54.32 78.13,60.35 78.13,66.86 75.43,69.56 57.02,69.56 51.78,74.8 51.78,82.73 52.41,83.37 55.27,83.37 55.9,82.73 55.9,76.38 58.28,74 78.45,74 84.32,68.13
VLIM  (via drill 0.5)
  Top 0.406: 42.57,51.62 39.87,54.32 | 30.34,24.31 31.14,24.31 40.03,33.2 40.03,34.95 40.03,44.31 v41.3,45.59 | 42.57,51.62 | v44.95,49.24 42.57,51.62 | 39.87,54.32 | 39.87,54.32 | 39.87,54.32 SV1.3 | R6.S | R6.S | 30.34,21.47 R16.S 27.49,19.87 25.89,18.27 R16.A | 30.34,21.47 R6.S | R6.S 33.04,21.45 | 30.34,21.47 30.34,24.31 | R6.A 31.44,18.27 32.09,18.91 32.88,19.71 33.04,19.87 R6.S | D5.C 30.82,24.31 30.34,24.31
  Bottom 0.406: v41.3,45.59 v44.95,49.24
VLIM_OUT
  Top 0.406: D1.A 36.85,13.84 37.01,13.68 37.01,13.72 D4.C 38.01,13.88 38.12,13.84 49.06,13.84 50.35,15.11 50.56,15.32 U1.9
VO
  Top 0.406: 67.49,8.12 | LCD.3 | LCD.3 67.49,8.12 | 67.49,8.12 67.49,9.71 70.83,13.04 79.08,13.04 | 79.08,13.04 79.24,13.2 79.24,12.88 79.08,13.04 | R35.S 79.08,13.04 | 79.08,13.04
VR  (via drill 0.6)
  Top 0.406: U1.25 56.16,25.9 | 56.16,25.9 56.16,26.16 56.38,26.54 C3.P$1 | SV1.2 37.33,81.94 36.06,80.67 36.06,53.84 43.52,46.38 v43.52,32.09 | v46.54,29.07 v49.24,26.38 | v55.11,26.38 55.69,26.38 56.16,25.9
  Bottom 0.406: v43.52,32.09 v46.54,29.07 | v49.24,26.38 v55.11,26.38

### Text on the board
Top: Top
Bottom: Bottom
tPlace: +12V | GND | GND | +5V
tStop: RF-Gen V0.5 | Supply and Controller | (c) 2013 C. Klippel/P. Almeida